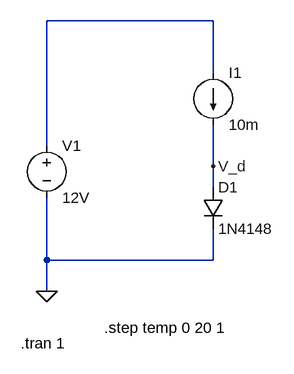
[diagram p0: schematic Lab2Part1.asc]
Lab2Part1.asc, the LTspice schematic file:
Version 4
SHEET 1 880 680
WIRE 352 -48 96 -48
WIRE 352 32 352 -48
WIRE 96 144 96 -48
WIRE 352 176 352 112
WIRE 352 208 352 176
WIRE 96 320 96 224
WIRE 352 320 352 272
WIRE 352 320 96 320
WIRE 96 368 96 320
FLAG 96 368 0
FLAG 352 176 V_d
SYMBOL voltage 96 128 R0
WINDOW 123 0 0 Left 0
WINDOW 39 0 0 Left 0
SYMATTR InstName V1
SYMATTR Value 12V
SYMBOL current 352 32 R0
WINDOW 123 0 0 Left 0
WINDOW 39 0 0 Left 0
SYMATTR InstName I1
SYMATTR Value 10m
SYMBOL diode 336 208 R0
SYMATTR InstName D1
SYMATTR Value 1N4148
TEXT 184 424 Left 2 !.step temp 0 20 1
TEXT 56 448 Left 2 !.tran 1

The netlist it stands for:
* Lab2Part1.asc
V1 N001 0 12V
I1 N001 V_d 10m
D1 V_d 0 1N4148
.model D D
.lib standard.dio
.step temp 0 20 1
.tran 1
.backanno
.end